# EAGLE board SDA381V8_B0 (EAGLE 9.6.2), part 1 of 6
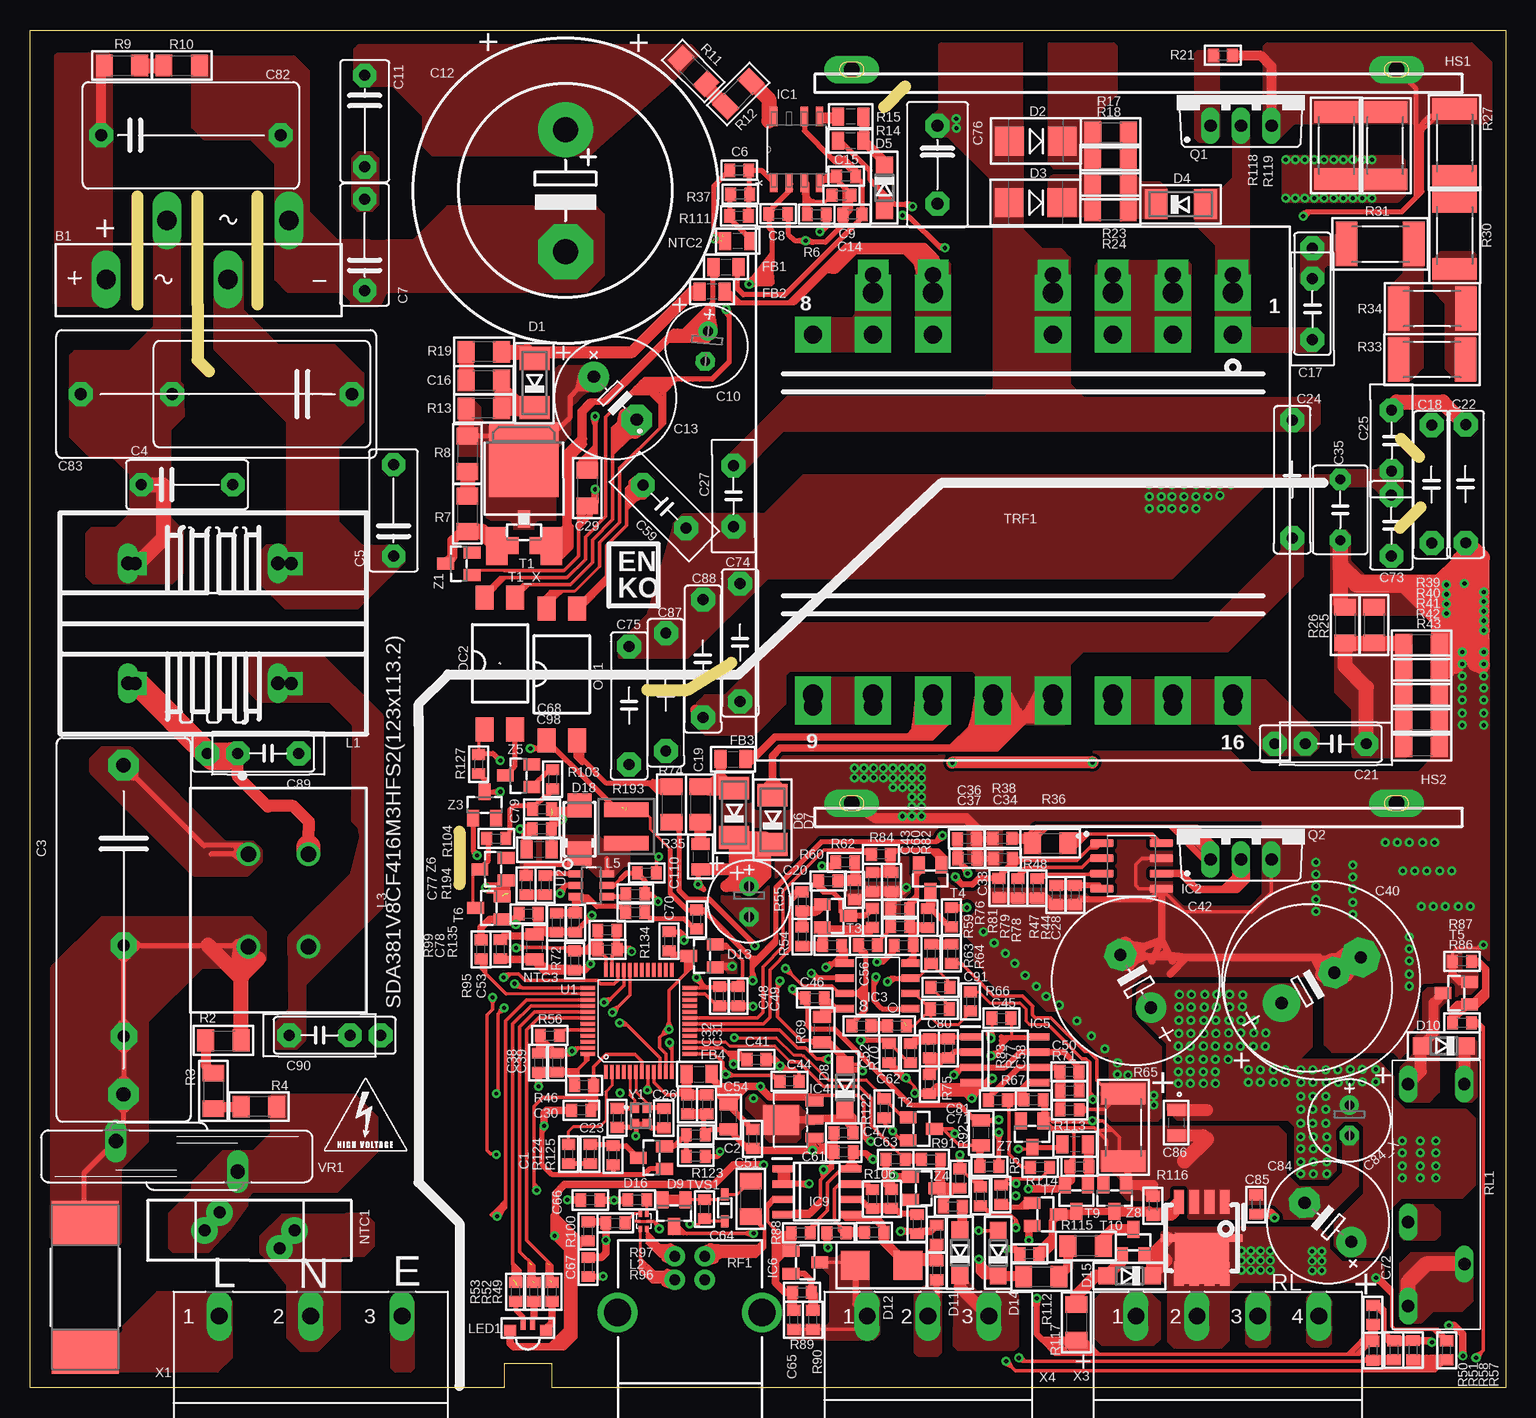
[diagram p2: board, top side]
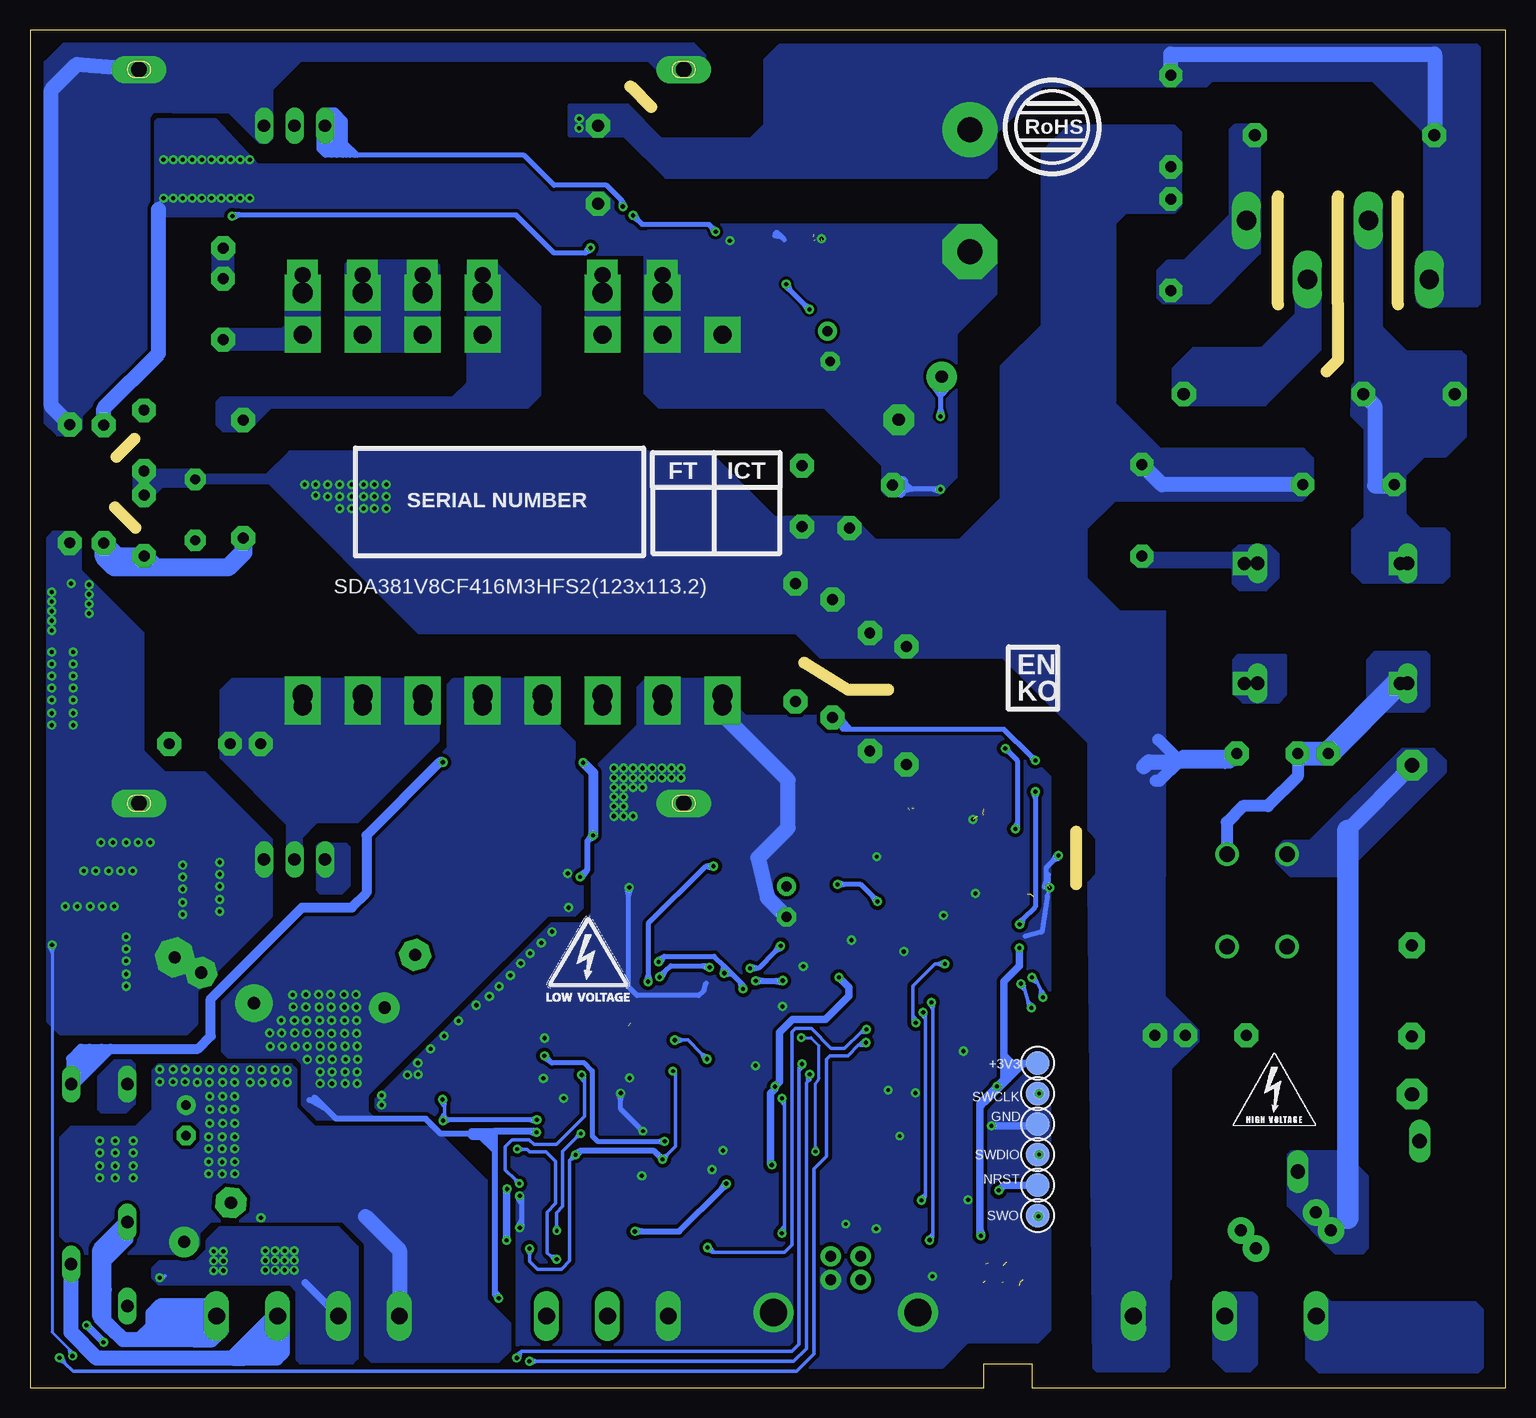
[diagram p3: board, bottom side, seen from below]

Size 123 x 113.2 mm. Coordinates in mm from the lower left corner, seen from the top.
Outline: 0,0 0,113.2 123,113.2 123,0 43.5,0 43.5,2 39.5,2 39.5,0 0,0
Copper layers (1*16): Top 0.035mm / dielectric 1.5mm / Bottom 0.035mm
Design rules "enkoarge *": minimum track width 10mil, minimum drill 0.3mm, track to track 9.5mil, track to pad 9.5mil, pad to pad 9.5mil, via to via 9.5mil, smd to smd 9.5mil, copper to edge 40mil, drill to drill 8mil, minimum pad ring 5mil, minimum via ring 8mil, stop-mask expansion 4mil, vias tented up to drill 0.35mm, thermal gap 11mil
Milling: 8 lines

## Footprints (pad centres in the part's own frame; a part is rotated, then mirrored left to right if it is on the bottom)
DıODE_BRIDGE_8A_DIK = drill 1.6 long: + -7.62,0.08; - 7.62,5; AC1 -2.54,5; AC2 2.54,0.08
C0603_ENKO = smd 0.9 x 1.1: 1 -0.794,0; 2 0.794,0
C275-113X316_&_C150-072X183_&_C225-113X268 = drill 1.194 pad 2.54 octagon: 1 -13.716,0; 2 13.716,0 | drill 1.016 pad 2.184 octagon: 3 -13.733,0.02; 4 8.873,0.02; 5 -13.693,0; 6 1.293,0
C075-042X103 = drill 0.914 pad 1.93 octagon: 1 -3.81,0; 2 3.81,0
E2,5-7 = drill 0.813 pad 1.6: + -1.27,0 | drill 0.813 pad 1.6 octagon: - 1.27,0
EB25D = drill 2.1 pad 4.597: + -5.08,0 | drill 2.1 pad 4.597 octagon: - 5.08,0
E5-10,5 = drill 1.016 pad 2.54: + -2.54,0 | drill 1.016 pad 2.54 octagon: - 2.54,0
C1206_ENKO = smd 1.4 x 1.8: 1 -1.479,0; 2 1.479,0
C075-32X103/C050-035X75 = drill 0.914 pad 2 octagon: 1 -3.81,0; 2 3.81,0 | drill 0.914 pad 1.981 octagon: 3 -3.81,0; 4 1.27,0
C075-32X103_DEIF = drill 0.914 pad 2 octagon: P$1 -4.92,0; P$2 4.92,0
C50-035X75 = drill 0.914 pad 1.981 octagon: 1 -2.54,0; 2 2.54,0
C050-045X075 = drill 0.813 pad 1.778 octagon: 1 -2.54,0; 2 2.54,0
E5-13/E7,5-16 = drill 1.016 pad 3.15: + -3.81,0 | drill 1.016 pad 2.54: +1 -3.81,0 | drill 1.016 pad 3.15 octagon: - 3.81,0 | drill 1.016 pad 2.54 octagon: -1 1.27,0
E5-13 = drill 1.016 pad 2.54: + -2.54,0 | drill 1.016 pad 2.54 octagon: - 2.54,0
C0805_ENKO = smd 1 x 1.5: 1 -1.052,0; 2 1.052,0
C050-035X075 = drill 0.914 pad 1.981 octagon: 1 -2.54,0; 2 2.54,0
C065-052X106 = drill 1 pad 2 octagon: 1 -3.25,0; 2 3.25,0
C150-091X182 = drill 1 pad 2 octagon: 1 -7.493,0; 2 7.493,0
C150-091X182_C225-108X268 = drill 1.016 pad 2 octagon: 1 -11.303,0; 2 11.303,0; 3 -11.303,0; 4 3.683,0
M7_DC_DIYOT = smd 1.9 x 2.5: A -2.05,0; C 2.05,0
SMB = smd 2.4 x 2.4: A 2.2,0; C -2.2,0
SOD123 = smd 1.4 x 1.4: A 1.9,0; C -1.9,0
SOT23 = smd 1 x 1.4: 1 -0.95,-1.1; 2 0.95,-1.1; 3 0,1.1
TRANSIL_SMB = smd 2.4 x 2.4: A 2.2,0; A1 -2.2,0
SMA = smd 2 x 2: A 2,0; C -2,0
FUSE_1350HV_EAT = smd 3.658 x 5.563: 1 -5.372,0; 2 5.372,0
R0805_ENKO = smd 1 x 1.5: 1 -1.052,0; 2 1.052,0
DEIF_SOGUTUCU_2 = drill 1.3 pad 2.3 long: 1 -23.9,0.91; 2 21.5,0.91
NCP1239_SMPS_IC = smd 1.6 x 0.6: 1 -2.76,1.905; 2 -2.76,0.635; 3 -2.76,-0.635; 4 -2.76,-1.905; 5 2.76,-1.905; 6 2.76,-0.635; 8 2.76,1.905
NCP4306 = smd 1.97 x 0.6: 1 -2.475,1.905; 2 -2.475,0.635; 3 -2.475,-0.635; 4 -2.475,-1.905; 5 2.475,-1.905; 6 2.475,-0.635; 7 2.475,0.635; 8 2.475,1.905
SO-8 = smd 1.524 x 0.61: 1 -2.743,1.92; 2 -2.743,0.65; 3 -2.743,-0.62; 4 -2.743,-1.89; 5 2.743,-1.89; 6 2.743,-0.62; 7 2.743,0.65; 8 2.743,1.92
SOT89 = smd 0.8 x 1.5: 1 -1.5,-1.75; 2 0,-1.75; 3 1.5,-1.75 | smd 2.5 x 3: 4 0,1.05
SO08 = smd 0.6 x 1.8: 1 -1.905,-2.8; 2 -0.635,-2.8; 3 0.635,-2.8; 4 1.905,-2.8; 5 1.905,2.8; 6 0.635,2.8; 7 -0.635,2.8; 8 -1.905,2.8
TL431_SOT23F = smd 1 x 1.4: A 0,1.2; C -0.95,-1.2; R 0.95,-1.2
TPH6R30ANL = smd 0.8 x 2: D 1.905,3; D1 0.635,3; D2 -0.635,3; D3 -1.905,3; GATE 1.905,-3; S -1.905,-3; S1 -0.635,-3; S2 0.635,-3 | smd 1.27 x 0.635: P$1 -2.75,0; P$2 2.75,0 | smd 4.5 x 4.25: P$3 0,1.7
UU1620_&_FWCMET24V = drill 1.1 pad 1.93 square: 1 -5,-6.5; 2 5,-6.5; 3 -5,6.5; 4 5,6.5 | drill 1.118 long: 5 -5,-5.385; 6 5,-5.385; 7 4.999,7.115; 8 -5.001,7.113
EXC24CS_COMMON_MODE = smd 0.4 x 0.2: 1 -0.5,0; 4 0.5,0 | smd 0.3 x 0.5: 2 -0.275,-0.625; 3 0.275,-0.625; 5 0.275,0.625; 6 -0.275,0.625
WE-CMB_NIZN_S = drill 1.3: 1 -3.85,-2.5; 2 3.85,-2.5; 3 3.85,2.5; 4 -3.85,2.5
INDUCTOR-NR4018 = smd 1.2 x 3.7: 1 -1.4,0; 2 1.4,0
KPFA-3010RGBC-11 = smd 1 x 0.9: 1 -1.5,0.2; 2 1.5,0.2 | smd 0.4 x 0.8: 3 0.4,-0.25; 4 -0.4,-0.25
NTC_15R_2A_&_N15SP005-5 = drill 1 pad 2.184: P$1 -2.5,1.5; P$2 2.5,-1.5; P$3 3.75,0; P$4 -3.75,0
PS2561DL2-1_OPTO1 = smd 1.5 x 2: 1 -1.27,-5.5; 2 1.27,-5.5; 3 1.27,5.5; 4 -1.27,5.5
PROG_6PIN = smd 2 x 2: 1 0,6.35; 2 0,3.81; 3 0,1.27; 4 0,-1.27; 5 0,-3.81; 6 0,-6.35
TO220BV = drill 1.016 long: D 0,-2.54; G -2.54,-2.54; S 2.54,-2.54
R1206_ENKO = smd 1.4 x 1.8: 1 -1.479,0; 2 1.479,0
R0603_ENKO = smd 0.9 x 1.1: 1 -0.794,0; 2 0.794,0
R2512 = smd 1.8 x 3.7: 1 -2.8,0; 2 2.8,0
ALD1_AND_ALJ_RELAY = drill 1.016 pad 1.27 long: 1 -8.997,-2.129; 2 -8.998,2.565; P0 9.505,-2.132; P1 6.007,2.571; S0 2.507,-2.129
DPAK = smd 1.8 x 3.2: 1 -2.28,-4.8; 3 2.28,-4.8 | smd 5.8 x 6.2: 4 0,2.38
SOT23-BEC = smd 1 x 1.4: B -0.95,-1.1; C 0,1.1; E 0.95,-1.1
DEIF_TRF = drill 1.7 pad 3 square: 1 -16.75,12.5; 2 -16.75,7.5; 3 -16.75,2.5; 5 -16.75,-7.5; 6 -16.75,-12.5; 6.5 16.75,-17.5; 7 16.75,-12.5; 8 16.75,-7.5; 9 16.75,-2.5; 10 16.75,2.5; 11 16.75,7.5; 12 16.75,12.5; 13 16.75,17.5; 55 -16.75,17.5 | drill 1.5 pad 3 square: 6.1 17.745,-17.5; 6.2 16.75,-17.5; 19 17.745,12.5; 20 17.745,7.5; 21 17.745,2.5; 22 17.745,-2.5; 23 17.745,-7.5; 24 17.745,-12.5; 25 17.745,17.5; 27 16.75,-12.5; 28 16.75,-7.5; 29 16.75,-2.5; 30 16.75,2.5; 31 16.75,7.5; 32 16.75,12.5; 38 16.75,17.5; 40 16.75,-17.5; 41 16.75,-12.5; 42 16.75,-7.5; 43 16.75,-2.5; 44 16.75,2.5; 45 16.75,7.5; 46 16.75,12.5; 47 16.75,17.5; 48 -13.25,-17.5; 49 -13.25,-12.5; 50 -13.25,-7.5; 52 -13.25,2.5; 53 -13.25,7.5; 54 -13.25,12.5; 58 -13.25,17.5 | drill 1.3 pad 2.54 square: 14 -18.255,-12.5; 15 -18.255,-7.5; 16 -18.255,2.5; 17 -18.255,7.5; 18 -18.255,12.5; 33 -18.25,-12.5; 34 -18.25,-7.5; 35 -18.25,2.5; 36 -18.25,7.5; 37 -18.25,12.5; 56 -18.255,17.5; 57 -18.25,17.5
SOD323 = smd 1 x 0.6: A 1.143,0; C -1.143,0
STM32F072CXXX_LQFP48 = smd 0.3 x 1.2: 1 -2.75,-4.25; 2 -2.25,-4.25; 3 -1.75,-4.25; 4 -1.25,-4.25; 5 -0.75,-4.25; 6 -0.25,-4.25; 7 0.25,-4.25; 8 0.75,-4.25; 9 1.25,-4.25; 10 1.75,-4.25; 11 2.25,-4.25; 12 2.75,-4.25; 25 2.75,4.25; 26 2.25,4.25; 27 1.75,4.25; 28 1.25,4.25; 29 0.75,4.25; 30 0.25,4.25; 31 -0.25,4.25; 32 -0.75,4.25; 33 -1.25,4.25; 34 -1.75,4.25; 35 -2.25,4.25; 36 -2.75,4.25 | smd 1.2 x 0.3: 13 4.25,-2.75; 14 4.25,-2.25; 15 4.25,-1.75; 16 4.25,-1.25; 17 4.25,-0.75; 18 4.25,-0.25; 19 4.25,0.25; 20 4.25,0.75; 21 4.25,1.25; 22 4.25,1.75; 23 4.25,2.25; 24 4.25,2.75; 37 -4.25,2.75; 38 -4.25,2.25; 39 -4.25,1.75; 40 -4.25,1.25; 41 -4.25,0.75; 42 -4.25,0.25; 43 -4.25,-0.25; 44 -4.25,-0.75; 45 -4.25,-1.25; 46 -4.25,-1.75; 47 -4.25,-2.25; 48 -4.25,-2.75
AOZ1282CI-1 = smd 1.2 x 0.6: 1 -1.298,0.95; 2 -1.298,0; 3 -1.298,-0.95; 4 1.298,-0.95; 5 1.298,0; 6 1.298,0.95
S20K40 = drill 1.194 long: 1 -1.27,-5.08; 2 1.27,5.08
GMSTBA3 = drill 1.397 long: 1 -7.62,5.08; 2 0,5.08; 3 7.62,5.08
USB_B(YATIK) = drill 0.914 pad 1.676: D+ 4,1.25; D- 5.981,1.25; GND 4,-1.25; VBUS 5.981,-1.25 | drill 2.286: SHLD1 1.282,-6.02; SHLD2 1.282,6.02
MSTBA4 = drill 1.397 long: 1 -7.62,5.08; 2 -2.54,5.08; 3 2.54,5.08; 4 7.62,5.08
MSTBA3 = drill 1.397 long: 1 -5.08,5.08; 2 0,5.08; 3 5.08,5.08
NX2016SA-32M = smd 0.85 x 0.75: 1 -0.675,-0.525; 2 0.675,-0.525; 3 0.675,0.525; 4 -0.675,0.525

## Placement (x,y rotation side)
B1  0119-1171**KOPRU DIYOT MONOFAZ 4A 1000V KBL  [DıODE_BRIDGE_8A_DIK]  13.97,92.33 0 top
C1  1019-3387**CAP 0603 CER 10uF 10V %10 X5R  [C0603_ENKO]  44.9,19.5 270 top
C2  1019-3387**CAP 0603 CER 10uF 10V %10 X5R  [C0603_ENKO]  55.5,21.1 180 top
C3  0019-2207**CAP TH POLY 1uF 305Vac %10 X2 MKP F=22.5mm (12x22x26.5)  [C275-113X316_&_C150-072X183_&_C225-113X268]  7.81,38.19 270 top
C4  1200920292**CAP TH CER 2.2nF 300Vac %20 X1Y2 F=7.5mm DxS(13x5)  [C075-042X103]  13.1,75.3 0 top
C5  1200920292**CAP TH CER 2.2nF 300Vac %20 X1Y2 F=7.5mm DxS(13x5)  [C075-042X103]  30.3,73.15 90 top
C6  1200920252**CAP 0603 CER 1nF 50V %10 X7R  [C0603_ENKO]  59.12,101.5 180 top
C7  1200920292**CAP TH CER 2.2nF 300Vac %20 X1Y2 F=7.5mm DxS(13x5)  [C075-042X103]  27.9,95.3 90 top
C8  1200920252**CAP 0603 CER 1nF 50V %10 X7R  [C0603_ENKO]  62.38,97.88 0 top
C9  1200920371**CAP 0603 CER 150p 50V%5 COG  [C0603_ENKO]  67.64,99.42 180 top
C10  0019-2279**CAP TH AL ELEC 47uF 50V %20 105C F=2.5/6.3x11 Low ESR, High Ripple Current  [E2,5-7]  56.4,86.84 265 top
C11  1200920292**CAP TH CER 2.2nF 300Vac %20 X1Y2 F=7.5mm DxS(13x5)  [C075-042X103]  27.9,105.6 270 top
C12  0019-3039**150uF 450V 105C %20 Ba:10 Yu: 41,5 çap: 25  [EB25D]  44.64,99.81 270 top
C13  0019-2196**CAP TH AL ELEC 47uF 100V %20 105C F=5/10x16  [E5-10,5]  48.79,82.5 315 top
C14  1200920567**CAP 0603 CER 1uF 25V %10X7R  [C0603_ENKO]  68.56,97.83 180 top
C15  1200920268**CAP 0603 CER 100nF 50V %10 X7R  [C0603_ENKO]  68.03,101 180 top
C16  NC**TAKILMAYACAK (Not Fitted)  [C1206_ENKO]  37.84,83.98 180 top
C17  0019-5007**CAP TH CER 150pF 630V COG %10 105C F=5  [C075-32X103/C050-035X75]  106.91,91.21 90 top
C18  0019-1298**CAP TH CER 1nF 500Vac X1/Y1 %20 F=10mm DxS(5x9)  [C075-32X103_DEIF]  116.84,75.33 90 top
C19  1200920078**CAP 1206 CER 1nF 50V %10 X7R  [C1206_ENKO]  55.86,48.64 90 top
C20  1200920283**CAP TH AL. ELEC 47uF 50V %20 105C L?1000H F=2.5/6.3x11  [E2,5-7]  59.94,40.54 270 top
C21  0019-1391**CAP TH CER 4700pF 250VAC 2.5kVDC X1Y2 %20 85C F=5mm  [C075-32X103/C050-035X75]  107.6,53.7 180 top
C22  0019-1298**CAP TH CER 1nF 500Vac X1/Y1 %20 F=10mm DxS(5x9)  [C075-32X103_DEIF]  119.67,75.37 90 top
C23  1019-3352**CAP 0603 CER 22pF 50V %5 NPO  [C0603_ENKO]  48.95,22.51 270 top
C24  0019-1299**CAP TH CER 2.2nF 500Vac X1/Y1 %20 F=10mm DxS(5x12)  [C075-32X103_DEIF]  105.22,75.75 90 top
C25  NC**TAKILMAYACAK (Not Fitted)  [C50-035X75]  113.5,78.96 90 top
C26  1019-3352**CAP 0603 CER 22pF 50V %5 NPO  [C0603_ENKO]  52.83,22.48 270 top
C27  NC**TAKILMAYACAK (Not Fitted)  [C50-035X75]  58.64,74.35 90 top
C28  1200920268**CAP 0603 CER 100nF 50V %10 X7R  [C0603_ENKO]  87.12,41.1 90 top
C29  NC**TAKILMAYACAK (Not Fitted)  [C1206_ENKO]  46.47,75.01 90 top
C30  1200920268**CAP 0603 CER 100nF 50V %10 X7R  [C0603_ENKO]  45.95,23.15 0 top
C31  1200920268**CAP 0603 CER 100nF 50V %10 X7R  [C0603_ENKO]  56.41,23.63 270 top
C32  1019-3167**CAP 0603 CER 10nF 50V %10 X7R (AbC)  [C0603_ENKO]  54.81,23.63 270 top
C33  1200920268**CAP 0603 CER 100nF 50V %10 X7R  [C0603_ENKO]  80.77,41.68 90 top
C34  1200920567**CAP 0603 CER 1uF 25V %10X7R  [C0603_ENKO]  81.11,44.14 0 top
C35  0019-1391**CAP TH CER 4700pF 250VAC 2.5kVDC X1Y2 %20 85C F=5mm  [C050-045X075]  109.23,73.2 90 top
C36  1200920268**CAP 0603 CER 100nF 50V %10 X7R  [C0603_ENKO]  78.11,45.77 0 top
C37  1200920268**CAP 0603 CER 100nF 50V %10 X7R  [C0603_ENKO]  78.14,44.12 0 top
C38  1200920268**CAP 0603 CER 100nF 50V %10 X7R  [C0603_ENKO]  42.41,27.11 90 top
C39  1019-3167**CAP 0603 CER 10nF 50V %10 X7R (AbC)  [C0603_ENKO]  43.91,27.12 90 top
C40  0019-3046**CAP TH AL ELEC 1000uF 35V %20 105C F=5/12.5x25 LOW ESR  [E5-13/E7,5-16]  107.63,33.98 30 top
C41  1200920268**CAP 0603 CER 100nF 50V %10 X7R  [C0603_ENKO]  60.57,27.37 0 top
C42  0019-3046**CAP TH AL ELEC 1000uF 35V %20 105C F=5/12.5x25 LOW ESR  [E5-13]  92.17,33.9 120 top
C43  1019-3387**CAP 0603 CER 10uF 10V %10 X5R  [C0603_ENKO]  68.72,41.52 90 top
C44  1200920268**CAP 0603 CER 100nF 50V %10 X7R  [C0603_ENKO]  63.3,25.56 0 top
C45  1200920268**CAP 0603 CER 100nF 50V %10 X7R  [C0603_ENKO]  80.98,30.82 180 top
C46  1200920268**CAP 0603 CER 100nF 50V %10 X7R  [C0603_ENKO]  65.42,32.51 0 top
C47  1200920567**CAP 0603 CER 1uF 25V %10X7R  [C0603_ENKO]  67.82,21.27 180 top
C48  1019-3167**CAP 0603 CER 10nF 50V %10 X7R (AbC)  [C0603_ENKO]  57.47,32.65 270 top
C49  1200920268**CAP 0603 CER 100nF 50V %10 X7R  [C0603_ENKO]  59.03,32.65 270 top
C50  NC**TAKILMAYACAK (Not Fitted)  [C0603_ENKO]  86.65,26.36 0 top
C51  1200920268**CAP 0603 CER 100nF 50V %10 X7R  [C0603_ENKO]  60.24,20.76 270 top
C52  1019-3158**CAP 0603 CER 220nF 25V %10 X7R (AbC)  [C0603_ENKO]  69.3,30.2 180 top
C53  1200920268**CAP 0603 CER 100nF 50V %10 X7R  [C0603_ENKO]  39.21,36.57 90 top
C54  1019-3301**CAP 0805 47uF 6.3V %20 X5R  [C0805_ENKO]  58.23,22.59 270 top
C55  1019-3167**CAP 0603 CER 10nF 50V %10 X7R (AbC)  [C0603_ENKO]  48.14,36.54 0 top
C56  1019-3158**CAP 0603 CER 220nF 25V %10 X7R (AbC)  [C0603_ENKO]  69.86,36.9 180 top
C57  1200920268**CAP 0603 CER 100nF 50V %10 X7R  [C0603_ENKO]  48.12,38.15 0 top
C58  1200920371**CAP 0603 CER 150p 50V%5 COG  [C0603_ENKO]  76.57,28.3 90 top
C59  NC**TAKILMAYACAK (Not Fitted)  [C50-035X75]  52.88,73.47 135 top
C60  1019-3387**CAP 0603 CER 10uF 10V %10 X5R  [C0603_ENKO]  70.24,42.18 90 top
C61  1200920268**CAP 0603 CER 100nF 50V %10 X7R  [C0603_ENKO]  67.84,19.66 180 top
C62  1200920268**CAP 0603 CER 100nF 50V %10 X7R  [C0603_ENKO]  71.63,27.92 90 top
C63  1019-3167**CAP 0603 CER 10nF 50V %10 X7R (AbC)  [C0603_ENKO]  72.16,19.06 180 top
C64  1200920268**CAP 0603 CER 100nF 50V %10 X7R  [C0603_ENKO]  56.23,14.91 270 top
C65  1200920268**CAP 0603 CER 100nF 50V %10 X7R  [C0603_ENKO]  63.66,5.67 90 top
C66  1019-3381**CAP 0603 CER 33pf 50V %5 NPO(COG)  [C0603_ENKO]  46.71,15.66 180 top
C67  1019-3381**CAP 0603 CER 33pf 50V %5 NPO(COG)  [C0603_ENKO]  46.53,10.08 270 top
C68  1200920268**CAP 0603 CER 100nF 50V %10 X7R  [C0603_ENKO]  42.69,48.25 180 top
C69  1200920268**CAP 0603 CER 100nF 50V %10 X7R  [C0603_ENKO]  79.23,15.96 90 top
C70  1200920268**CAP 0603 CER 100nF 50V %10 X7R  [C0603_ENKO]  53.26,37.23 270 top
C71  1200920082**CAP 0805 CER 100nF 50V %10 X7R  [C0805_ENKO]  79.29,21.26 90 top
C72  1019-3167**CAP 0603 CER 10nF 50V %10 X7R (AbC)  [C0603_ENKO]  111.95,6.1 270 top
C73  0019-1391**CAP TH CER 4700pF 250VAC 2.5kVDC X1Y2 %20 85C F=5mm  [C050-035X075]  113.49,71.9 90 top
C74  0019-1391**CAP TH CER 4700pF 250VAC 2.5kVDC X1Y2 %20 85C F=5mm  [C075-32X103_DEIF]  59.2,62.15 90 top
C75  0019-1391**CAP TH CER 4700pF 250VAC 2.5kVDC X1Y2 %20 85C F=5mm  [C075-32X103_DEIF]  49.95,56.9 90 top
C76  NC**TAKILMAYACAK (Not Fitted)  [C065-052X106]  75.64,101.98 270 top
C77  1200920268**CAP 0603 CER 100nF 50V %10 X7R  [C0603_ENKO]  41.36,41.91 90 top
C78  1019-3352**CAP 0603 CER 22pF 50V %5 NPO  [C0603_ENKO]  43.89,38.78 270 top
C79  1019-3243**CAP 0805 CER 10uF 50V ±10% X5R -55°C ~ 85°C  [C0805_ENKO]  42.43,44.87 180 top
C80  NC**TAKILMAYACAK (Not Fitted)  [C0603_ENKO]  75.86,31.57 0 top
C81  NC**TAKILMAYACAK (Not Fitted)  [C0603_ENKO]  80.69,23.99 0 top
C82  NC**TAKILMAYACAK (Not Fitted)  [C150-091X182]  13.41,104.42 0 top
C83  0019-1383**CAP TH POLY 220nF 305Vac 105C %20 X2 F=15/7x13.5x18  [C150-091X182_C225-108X268]  15.53,82.84 180 top
C84  0019-7012**CAP TH AL. ELEC 470uF 35V %20 105C F=5/10X16 L.ESR 3000H  [E5-10,5]  108.2,13.8 140 top
C84_X  NC**TAKILMAYACAK (Not Fitted)  [E2,5-7]  109.99,22.31 270 top
C85  1200920268**CAP 0603 CER 100nF 50V %10 X7R  [C0603_ENKO]  102.2,15.29 90 top
C86  1200920082**CAP 0805 CER 100nF 50V %10 X7R  [C0805_ENKO]  95.55,22.12 270 top
C87  0019-3044**CAP TH CER 1nF 400VAC X1 %20 85C F=5 veya F=7.5 D=6.5  [C075-32X103_DEIF]  53,58 90 top
C88  0019-3044**CAP TH CER 1nF 400VAC X1 %20 85C F=5 veya F=7.5 D=6.5  [C075-32X103_DEIF]  56.1,60.8 90 top
C89  0019-1296**CAP TH CER 470pF 300Vac X1/Y2 %20 F=7.5mm DxS(5x8)  [C075-32X103/C050-035X75]  18.6,52.9 180 top
C90  0019-1296**CAP TH CER 470pF 300Vac X1/Y2 %20 F=7.5mm DxS(5x8)  [C075-32X103/C050-035X75]  25.4,29.4 0 top
C91  NC**TAKILMAYACAK (Not Fitted)  [C0603_ENKO]  75.9,33.4 180 top
C98  1200920252**CAP 0603 CER 1nF 50V %10 X7R  [C0603_ENKO]  42.67,46.59 180 top
C110  1200920268**CAP 0603 CER 100nF 50V %10 X7R  [C0603_ENKO]  51.42,42.94 180 top
D1  1200980554**DIODE SWITCHING SM 1000V 1A US1M  [M7_DC_DIYOT]  42.06,83.77 270 top
D2  1119-3074**P6SMB300CA - DIODE TVS 600W 256V DO214AA (SMB)  [SMB]  83.84,103.94 180 top
D3  1119-3074**P6SMB300CA - DIODE TVS 600W 256V DO214AA (SMB)  [SMB]  83.82,98.81 180 top
D4  1200980554**DIODE SWITCHING SM 1000V 1A US1M  [M7_DC_DIYOT]  95.92,98.66 180 top
D5  NC**AKILMAYACAK (Not Fitted)  [SOD123]  71.22,100.05 270 top
D6  1200980554**DIODE SWITCHING SM 1000V 1A US1M  [M7_DC_DIYOT]  58.69,47.94 270 top
D7  1200980468**DIODE RECTIFIER SMD 1000V 1A GS1M  [M7_DC_DIYOT]  61.89,47.36 270 top
D8  1200980377**DIODE SWITCHING SMD 75V 200mA SOD-123 1N4148W  [SOD123]  67.95,25.05 90 top
D9  1119-3027**DIODE 75V 200MA SOT23 BAS16 (AbC)  [SOT23]  53.68,14.57 180 top
D10  1200980377**DIODE SWITCHING SMD 75V 200mA SOD-123 1N4148W  [SOD123]  117.85,28.52 180 top
D11  1200980377**DIODE SWITCHING SMD 75V 200mA SOD-123 1N4148W  [SOD123]  77.52,11.28 90 top
D12  1119-3072**DIODE TVS 600W 12V DO214AA BIPOLAR  [TRANSIL_SMB]  71,10.22 0 top
D13  1200980593**DIODE SCHOTTKY BARRIER DOUBLE SMD 30V 200mA BAT54S  [SOT23]  56.02,36.02 90 top
D14  1200980377**DIODE SWITCHING SMD 75V 200mA SOD-123 1N4148W  [SOD123]  80.71,11.24 90 top
D15  1200980377**DIODE SWITCHING SMD 75V 200mA SOD-123 1N4148W  [SOD123]  91.66,9.34 180 top
D16  1200980593**DIODE SCHOTTKY BARRIER DOUBLE SMD 30V 200mA BAT54S  [SOT23]  51.8,19.2 90 top
D18  1200980432**DIODE SCHOTTKY RECTIFIER SMD SMA/DO_214AC 60V 2A STPS2L60A  [SMA]  45.81,46.56 90 top
F1  1169-1203**FUSE SMD 5A 350VAC 500VDC 2-SMD Breaking Cap: 100A I2t:11.5  [FUSE_1350HV_EAT]  4.6,8.4 90 top
FB1  1319-4060**Ferrite Bead SMD 0805 2kOhm@100MHz 300mA LAIRD HZ0805C202R-10  [R0805_ENKO]  58.02,93.45 0 top
FB2  1319-4060**Ferrite Bead SMD 0805 2kOhm@100MHz 300mA LAIRD HZ0805C202R-10  [R0805_ENKO]  56.85,91.38 180 top
FB3  1319-4060**Ferrite Bead SMD 0805 2kOhm@100MHz 300mA LAIRD HZ0805C202R-10  [R0805_ENKO]  58.6,52.41 0 top
FB4  1319-4060**Ferrite Bead SMD 0805 2kOhm@100MHz 300mA LAIRD HZ0805C202R-10  [R0805_ENKO]  55.76,26.16 0 top
HS1  0139-1131**DBC2 90/150W Heatsink Düz Formlu [ARGE?]  [DEIF_SOGUTUCU_2]  92.41,109 0 top
HS2  0139-1131**DBC2 90/150W Heatsink Düz Formlu [ARGE?]  [DEIF_SOGUTUCU_2]  92.41,47.82 0 top
IC1  1039-9014**IC SMPS CONTROLLER FLYBACK FIXED FREQ. ONSEMI NCP1239ED65R2G  [NCP1239_SMPS_IC]  63.91,103.24 90 top
IC2  1039-9013**NCP4306AADZZZADR2G SOIC-8 (senkron IC) Synchronous Rectification Controller for Flyback  [NCP4306]  91.83,43.51 0 top
IC3  1039-2224**TSM1011ID SO-8 Constant Voltage and Constant Current Controller  [SO-8]  70.66,33.53 180 top
IC4  1039-3003**Voltage Regulator SOT-89 3.3V Diodes AP2204RA-3.3TRG1  [SOT89]  63.65,22.36 90 top
IC5  1039-2009**OPAMP 3-32 V Dual 70C SO8 LM358  [SO08]  81.28,27.36 270 top
IC6  1200980448**IC REGULATOR VOLTAGE SMD ZTL431AFFTA 2.5V %1  [TL431_SOT23F]  64.63,10.46 270 top
IC8  1109-4211**Mosfet N-Ch 100V 90A Rds:3.7mR 8-SOP Advance (5x5) TPH3R70APL  [TPH6R30ANL]  97.67,12.5 180 top
IC9  1039-2009**OPAMP 3-32 V Dual 70C SO8 LM358  [SO08]  65.59,16.36 270 top
L1  0319-5030**LINE FILTER 2x7mH 1,5A COMMON MODE CHOKE (UU1620)  [UU1620_&_FWCMET24V]  15.28,63.73 90 top
L2  1319-4100**EXC24 Common Mode Noise Filters with ESD Suppressor(0504 Size)  [EXC24CS_COMMON_MODE]  51.15,13.9 0 top
L3  0319-7457**Common Mode Chokes / Filters WE-CMB Power Type S 42uH 100kHz 8.1mOhm 744842742  [WE-CMB_NIZN_S]  20.7,40.65 270 top
L5  1319-4102**INDUCTOR POWER 22UH 4X4X1.8MM SMD  [INDUCTOR-NR4018]  49.7,46.8 90 top
LED1  1209-0011**LED, RGB, Red, Green, Blue, SMD, 1mm x 3mm, 120 °, Dome, R 20mA, G 20mA, B 20mA (Right Angle)  [KPFA-3010RGBC-11]  41.5,5 180 top
NTC1  0169-2029**SURGE PROTECTOR-In rush Current Limitter NTC N10SP005  [NTC_15R_2A_&_N15SP005-5]  18.3,13.12 0 top
NTC2  1200970116**RES 0805 0R %5  [R0805_ENKO]  59,95.6 180 top
NTC3  1169-1001**TSM2A103F3951RZ THINKING 0805 10K NTC 125C  [R0805_ENKO]  42.08,36.77 90 top
OC1  1200980560**OPTOCOUPLER SMD PS2561DL2-1Y-V-F3-A/L CTR: 200˜400  [PS2561DL2-1_OPTO1]  44.34,59.48 0 top
OC2  1200980560**OPTOCOUPLER SMD PS2561DL2-1Y-V-F3-A/L CTR: 200˜400  [PS2561DL2-1_OPTO1]  39.18,60.4 0 top
PCB  0369-5199**PCB [ARGE?] SDA381V8CF416M3HFS2(123x113.2)  [PCB]  -5.84,108.92 0 top  (outside the outline)
PROG1  NC**TAKILMAYACAK (Not Fitted)  [PROG_6PIN]  38.98,20.71 0 bottom
Q1  0109-4091**Mosfet N-Ch 800V 9A 0.16R TO-220FP Vishay SIHA24N80AE-GE3 [ARGE?]  [TO220BV]  100.95,107.76 0 top
Q2  1109-4204**Mosfet N-Ch 100V 64A Rds:4.5mR TO-220FP  [TO220BV]  100.95,46.59 0 top
R2  1200970587**RES 1206 470K %5 1/4W  [R1206_ENKO]  16.13,28.97 180 top
R3  1200970587**RES 1206 470K %5 1/4W  [R1206_ENKO]  15.28,24.77 90 top
R4  1200970587**RES 1206 470K %5 1/4W  [R1206_ENKO]  19.09,23.44 0 top
R5  NC**TAKILMAYACAK  [R0603_ENKO]  84.2,18.4 0 top
R6  1200970583**RES 0603 1K %1 1/10W  [R0603_ENKO]  65.59,97.83 0 top
R7  1029-4050**RES 1206 6K8 %1  [R1206_ENKO]  36.46,72.87 90 top
R8  1029-4050**RES 1206 6K8 %1  [R1206_ENKO]  36.47,77.86 90 top
R9  1200970179**RES 1206 330K %5 1/4W  [R1206_ENKO]  7.68,110.24 180 top
R10  1200970179**RES 1206 330K %5 1/4W  [R1206_ENKO]  12.65,110.23 180 top
R11  1200970154**RES 1206 2K2 %5 1/4W  [R1206_ENKO]  55.31,109.77 135 top
R12  1200970154**RES 1206 2K2 %5 1/4W  [R1206_ENKO]  59.04,107.87 45 top
R13  1029-3146**RES 1206 7R68 %1  [R1206_ENKO]  37.83,81.64 0 top
R14  1200970118**RES 0805 100R %5 1/8W  [R0805_ENKO]  68.41,103.99 0 top
R15  1200970434**RES 0805 47R %5 1/8W  [R0805_ENKO]  68.41,105.98 180 top
R17  1029-3146**RES 1206 7R68 %1  [R1206_ENKO]  90.09,104.63 0 top
R18  1029-3146**RES 1206 7R68 %1  [R1206_ENKO]  90.07,102.44 0 top
R19  NC**TAKILMAYACAK (Not Fitted)  [R1206_ENKO]  37.84,86.36 0 top
R21  1200970568**RES 0603 47K %5 1/10W  [R0603_ENKO]  99.44,111.08 180 top
R23  1029-3146**RES 1206 7R68 %1  [R1206_ENKO]  90.07,100.3 0 top
R24  1029-3146**RES 1206 7R68 %1  [R1206_ENKO]  90.07,98.18 0 top
R25  1200970119**RES 1206 100R %5 1/4W  [R1206_ENKO]  112.05,63.59 90 top
R26  1200970119**RES 1206 100R %5 1/4W  [R1206_ENKO]  109.64,63.59 90 top
R27  1029-6097**RES 2512 22R %5 1W  [R2512]  118.75,103.81 270 top
R30  1029-6097**RES 2512 22R %5 1W  [R2512]  118.76,96.07 270 top
R31  1029-6097**RES 2512 22R %5 1W  [R2512]  112.55,95.36 0 top
R33  1029-6110**RES 2512 47R %5 1W  [R2512]  116.88,85.72 180 top
R34  1029-6110**RES 2512 47R %5 1W  [R2512]  116.89,89.97 180 top
R35  1029-3008**RES 0805 22R %5  [R0805_ENKO]  55.89,44.28 270 top
R36  1200970117**RES 1206 0R %5  [R1206_ENKO]  85.05,45.41 180 top
R37  1200970687**RES 0603 56K %1 1/10W  [R0603_ENKO]  59.2,99.5 180 top
R38  1200970568**RES 0603 47K %5 1/10W  [R0603_ENKO]  81.07,45.8 180 top
R39  1200970119**RES 1206 100R %5 1/4W  [R1206_ENKO]  116,61.95 0 top
R40  1200970119**RES 1206 100R %5 1/4W  [R1206_ENKO]  116,59.87 0 top
R41  1200970119**RES 1206 100R %5 1/4W  [R1206_ENKO]  116,57.78 0 top
R42  1200970119**RES 1206 100R %5 1/4W  [R1206_ENKO]  116,55.64 0 top
R43  1200970554**RES 1206 56R %1 1/4W  [R1206_ENKO]  116,53.48 0 top
R44  1200970568**RES 0603 47K %5 1/10W  [R0603_ENKO]  85.54,41.1 270 top
R46  1200971020**RES 0603 10K %1 1/10W  [R0603_ENKO]  46.18,25.23 0 top
R47  1200971020**RES 0603 10K %1 1/10W  [R0603_ENKO]  83.95,41.65 270 top
R48  1200970516**RES 0603 22K %5 1/10W  [R0603_ENKO]  82.36,41.65 270 top
R49  1029-2005**RES 0603 220R %1  [R0603_ENKO]  43.52,8.02 270 top
R50  1200970803**RES 0603 100K %1 1/10W  [R0603_ENKO]  111.95,3.11 270 top
R51  1200971020**RES 0603 10K %1 1/10W  [R0603_ENKO]  113.71,3.15 90 top
R52  1029-2005**RES 0603 220R %1  [R0603_ENKO]  42,8.02 270 top
R53  1029-2005**RES 0603 220R %1  [R0603_ENKO]  40.48,8.02 270 top
R54  1200971020**RES 0603 10K %1 1/10W  [R0603_ENKO]  64.36,37.61 90 top
R55  1029-2233**RES 0603 2K2 %1  [R0603_ENKO]  64.36,40.56 90 top
R56  1200970522**RES 0603 1K %5 1/10W  [R0603_ENKO]  43.34,29.38 0 top
R57  1200970803**RES 0603 100K %1 1/10W  [R0603_ENKO]  118.09,3.15 270 top
R58  1200970770**RES 0603 4K3 %1 1/10W  [R0603_ENKO]  115.29,3.15 90 top
R59  1200970803**RES 0603 100K %1 1/10W  [R0603_ENKO]  70.22,39.17 270 top
R60  1029-2234**RES 0603 4K7 %1  [R0603_ENKO]  66.53,42.25 0 top
R61  1200970583**RES 0603 1K %1 1/10W  [R0603_ENKO]  66.87,36.9 0 top
R62  1200970706**RES 0603 1K8 %5 1/10W  [R0603_ENKO]  67.96,43.82 0 top
R63  1029-2003**RES 0603 10R %1  [R0603_ENKO]  75.12,36.19 270 top
R64  1029-2006**RES 0603 47R %1  [R0603_ENKO]  76.83,36.19 90 top
R65  1029-6021**RES 2512 0R003 %1 2W  [R2512]  91.14,21.72 270 top
R66  1200970927**RES 0603 100R %1 1/10W  [R0603_ENKO]  78.4,32.22 90 top
R67  1200970522**RES 0603 1K %5 1/10W  [R0603_ENKO]  83.66,24.01 0 top
R68  1200970522**RES 0603 1K %5 1/10W  [R0603_ENKO]  86.66,23.17 180 top
R69  1029-3008**RES 0805 22R %5  [R0805_ENKO]  66.03,29.87 90 top
R70  1200970843**RES 0603 15K %1 1/10W  [R0603_ENKO]  72.28,30.19 0 top
R71  1029-2234**RES 0603 4K7 %1  [R0603_ENKO]  86.67,24.79 0 top
R72  1200970583**RES 0603 1K %1 1/10W  [R0603_ENKO]  45.41,35.63 90 top
R74  1200970194**RES 1206 4K7 %5 1/4W  [R1206_ENKO]  53.48,48.64 90 top
R75  1200970583**RES 0603 1K %1 1/10W  [R0603_ENKO]  74.97,25.33 90 top
R76  1200970684**RES 0603 47K %1 1/10W  [R0603_ENKO]  72.54,38.49 0 top
R77  1029-6089**RES 0603 6K8 %5  [R0603_ENKO]  74.98,28.3 90 top
R78  1029-2203**RES 0603 12K %1  [R0603_ENKO]  76.82,39.23 90 top
R79  1029-2341**RES 0603 5K6 %1  [R0603_ENKO]  74.83,39.16 90 top
R80  1029-2234**RES 0603 4K7 %1  [R0603_ENKO]  72.83,36.89 0 top
R81  1200970583**RES 0603 1K %1 1/10W  [R0603_ENKO]  72.54,39.91 180 top
R82  1200971020**RES 0603 10K %1 1/10W  [R0603_ENKO]  71.83,42.19 270 top
R83  1200970522**RES 0603 1K %5 1/10W  [R0603_ENKO]  73.4,27.91 270 top
R84  1200970522**RES 0603 1K %5 1/10W  [R0603_ENKO]  70.94,44.48 0 top
R86  1200970522**RES 0603 1K %5 1/10W  [R0603_ENKO]  119.37,30.43 0 top
R87  1200971020**RES 0603 10K %1 1/10W  [R0603_ENKO]  119.37,35.56 0 top
R88  1029-2234**RES 0603 4K7 %1  [R0603_ENKO]  64.25,12.94 0 top
R89  1200970583**RES 0603 1K %1 1/10W  [R0603_ENKO]  64.35,7.96 180 top
R90  1029-2231**RES 0603 1K8 %1  [R0603_ENKO]  65.25,5.67 90 top
R91  1200971020**RES 0603 10K %1 1/10W  [R0603_ENKO]  75.12,19.05 0 top
R92  1200970568**RES 0603 47K %5 1/10W  [R0603_ENKO]  77.52,17.46 270 top
R93  1409-0025**RES 0603 470R %5 1/16W  [R0603_ENKO]  76.93,15.12 180 top
R94  1029-6086**RES 0603 22R %1  [R0603_ENKO]  75.59,9.79 90 top
R95  1200970583**RES 0603 1K %1 1/10W  [R0603_ENKO]  37.6,36.55 270 top
R96  1029-6086**RES 0603 22R %1  [R0603_ENKO]  48.8,13.76 180 top
R97  1029-6086**RES 0603 22R %1  [R0603_ENKO]  50.62,15.68 180 top
R98  1029-2234**RES 0603 4K7 %1  [R0603_ENKO]  75.58,12.78 90 top
R99  1200970516**RES 0603 22K %5 1/10W  [R0603_ENKO]  41.56,39.53 180 top
R100  1200970852**RES 0603 1K5 %5 1/10W ( <-1029-3501 )  [R0603_ENKO]  46.52,13.05 270 top
R101  1200970684**RES 0603 47K %1 1/10W  [R0603_ENKO]  73.95,13.65 270 top
R102  1200970583**RES 0603 1K %1 1/10W  [R0603_ENKO]  71.82,15.76 270 top
R103  1200970522**RES 0603 1K %5 1/10W  [R0603_ENKO]  43.57,50.74 90 top
R104  1200970522**RES 0603 1K %5 1/10W  [R0603_ENKO]  38.87,45.8 0 top
R105  1029-2229**RES 0603 120K %1  [R0603_ENKO]  70.38,12.97 180 top
R106  1029-2219**RES 0603 30K %1  [R0603_ENKO]  70.23,15.74 90 top
R107  1200970515**RES 0603 100K %5 1/10W  [R0603_ENKO]  83.31,11.17 180 top
R108  1200970730**RES 0603 560R %1 1/10W  [R0603_ENKO]  67.23,12.94 180 top
R109  1200971020**RES 0603 10K %1 1/10W  [R0603_ENKO]  80.95,16.11 90 top
R110  1200970516**RES 0603 22K %5 1/10W  [R0603_ENKO]  79.98,18.46 0 top
R111  NC**TAKILMAYACAK  [R0603_ENKO]  59.1,97.7 180 top
R112  1200970156**RES 1206 22K %5 1/4W  [R1206_ENKO]  84.3,9.29 180 top
R113  1200970121**RES 0805 1K %5 1/8W  [R0805_ENKO]  87.13,20.3 180 top
R114  1200971020**RES 0603 10K %1 1/10W  [R0603_ENKO]  87.49,18.46 180 top
R115  1200970156**RES 1206 22K %5 1/4W  [R1206_ENKO]  88.01,11.83 0 top
R116  1200970585**RES 0603 1M %5 1/10W  [R0603_ENKO]  93.61,15.19 270 top
R117  1029-6015**RES 1206 56K %5  [R1206_ENKO]  87.23,5.47 90 top
R118  1029-6105**RES 2512 330mR %1 2W  [R2512]  108.92,103.57 90 top
R119  1029-6105**RES 2512 330mR %1 2W  [R2512]  112.97,103.55 90 top
R122  1200970516**RES 0603 22K %5 1/10W  [R0603_ENKO]  71.2,23.3 90 top
R123  1200970522**RES 0603 1K %5 1/10W  [R0603_ENKO]  55.5,19.3 0 top
R124  1200970522**RES 0603 1K %5 1/10W  [R0603_ENKO]  46.7,19.5 90 top
R125  1200970516**RES 0603 22K %5 1/10W  [R0603_ENKO]  48.6,19.4 90 top
R127  1200971020**RES 0603 10K %1 1/10W  [R0603_ENKO]  37.4,52 90 top
R133  1200970626**RES 0603 82K %1 1/10W  [R0603_ENKO]  55.56,39.05 90 top
R134  1029-2234**RES 0603 4K7 %1  [R0603_ENKO]  50.45,39.66 0 top
R135  1200970940**RES 0603 6K8 %1 1/10W  [R0603_ENKO]  45.46,38.79 90 top
R193  1200970934**RES 0603 470K %1 1/10W  [R0603_ENKO]  50.45,41.17 0 top
R194  1200970528**RES 0603 0R %5 1/10W  [R0603_ENKO]  42.95,41.91 270 top
RF1  1169-1006**FUSE SMD 1206 PTC RESETTABLE 16V IHOLD=0.75A IMAX=100A  [R1206_ENKO]  60.07,15.76 270 top
RL1  1200930051**RELAY SPST 12V 5A 7x15x20.3mm  [ALD1_AND_ALJ_RELAY]  117.01,16.33 270 top
STENCIL  041-7604**SDA381V8 için Çerçeveli Elek (Stencil) (600x600)  [PCB]  -5.88,105.57 0 top  (outside the outline)
T1  1109-1016**Transistor NPN 3A 100V 15W Hfemin:10 DPAK Diodes MJD31C-13  [DPAK]  41.18,74.98 0 top
T1_X  NC**TAKILMAYACAK (Not Fitted)  [SOT23-BEC]  41.18,71.32 0 top
T2  1200980090**TRANS SMD NPN BC847B SOT-23  [SOT23-BEC]  74.3,21.6 270 top
T3  1200980091**TRANS SMD PNP BC857B SOT-23  [SOT23-BEC]  67.14,39.35 270 top
T4  1200980090**TRANS SMD NPN BC847B SOT-23  [SOT23-BEC]  75.04,42.48 180 top
T5  1200980090**TRANS SMD NPN BC847B SOT-23  [SOT23-BEC]  118.89,32.91 90 top
T6  1200980090**TRANS SMD NPN BC847B SOT-23  [SOT23-BEC]  38.25,40.02 90 top
T7  1200980090**TRANS SMD NPN BC847B SOT-23  [SOT23-BEC]  84.63,14.46 270 top
T9  1200980090**TRANS SMD NPN BC847B SOT-23  [SOT23-BEC]  87.23,15.82 180 top
T10  1049-1012**MMBTA56 PNP 80V 500mA 330mW hfe(min):100 SOT23  [SOT23-BEC]  91.96,12.13 0 top
TRF1  0319-7458**SMPS TRAFO 90W E36/18/11 2*60uH (Insulation Improved 0319-7451) DBC2  [DEIF_TRF]  82.77,74.53 270 top
TVS1  1119-3061**5V 130W TVS Diode SOD-323  [SOD323]  57.92,15.01 270 top
U1  1039-2220**STM32F072C8T6 64K Flash USB, CAN  [STM32F072CXXX_LQFP48]  50.76,30.6 0 top
U2  1039-2392**LMR16006XDDCR 0.6A, 0.7MHz Step-Down Converter in a TSOT-6L, Input 4V to 60V  [AOZ1282CI-1]  46.8,41.9 0 top
U$1  [SERI_NO_ETIKET_ALANI]  82.66,73.95 180 bottom
U$2  [EN-KO_AMLEMI]  50.36,67.67 0 top
U$3  [EN-KO_AMLEMI]  39.33,59.08 0 bottom
U$4  [ROHS]  37.78,105.11 0 bottom
U$5  [FT-ICT]  66,73.88 0 bottom
VR1  0169-2013**Varistor 20mm 300V  [S20K40]  12.23,19.31 270 top
X1  0289-1472**WR-TBL Series 3134 - 3 kutup 7.62 mm Close Hor. PCB Header (Wurth 691 313 410 003)  [GMSTBA3]  23.4,0.91 0 top
X1-K  0289-1473**WR-TBL Series 3524 - 3 kutup 7.62 mm Hor. w. Hook on Wire Side (Wurth 691 352 410 003)  [SOKET]  -5.84,108.2 0 top  (outside the outline)
X2  0309-1064**USB Type-B Mini Connector Horizantal  [USB_B(YATIK)]  55,5 90 top
X3  0289-1470**WR-TBL Series 313 - 4 kutup 5.08 mm Close Hor. PCB Header (Wurth 691 313 510 004)  [MSTBA4]  99.83,0.91 0 top
X3-K  0289-1471**WR-TBL Series 352 - 4 kutup 5.08 mm Hor. with Hook on Wire Side (wurth 691 352 510 004)  [SOKET]  -5.84,107.46 0 top  (outside the outline)
X4  0289-1474**WR-TBL Series 313 - 3 kutup 5.08 mm Close Hor. PCB Header (Wurth 691 313 510 003)  [MSTBA3]  74.87,0.91 0 top
X4-K  0289-1475**WR-TBL Series 352 - 3 kutup 5.08 mm Hor. with Hook on Wire Side (wurth 691 352 510 003)  [SOKET]  -5.86,106.63 0 top  (outside the outline)
Y1  1149-0013**Crystal 16MHz ±10ppm 10pF 120 Ohms 4-SMD, No Lead 2.00mm x 1.60mm  [NX2016SA-32M]  50.9,22.7 270 top
Z1  1129-1195**ZENER SOT23 18V 400mW %5 BZX84C18V  [SOT23]  35.75,68.7 90 top
Z3  1129-1146**ZENER SOT23 2V7 300mW BZX84C2V7  [SOT23]  37.9,48.6 0 top
Z4  1129-1162**ZENER SOT23 3V9 300mW BZX84C3V9  [SOT23]  74.5,16.64 270 top
Z5  1129-1151**ZENER SOT23 12V 225mW BZX84C12  [SOT23]  40.73,51.04 90 top
Z6  1129-1146**ZENER SOT23 2V7 300mW BZX84C2V7  [SOT23]  38.6,43.24 90 top
Z7  1129-1151**ZENER SOT23 12V 225mW BZX84C12  [SOT23]  83.55,21.17 180 top
Z8  1129-1140**ZENER SOT23 5V1 0.4W BZX84C5V1  [SOT23]  90.41,15.82 180 top

## Tracks (layer width: path | path; a pad name or v marks a point on that pad's centre or on a via)
13.8V+  (via drill 0.35)
  Top 0.254: 37.91,54.69 37.41,54.19 37.41,52.8 R127.2 | C85.1
  Top 0.305: 110.51,2.81 110.83,2.81 111.92,3.9 R50.1 | 110.51,2.81 110.11,2.81 | 110.11,2.81 109.81,2.81 | 109.81,2.81 89.15,2.81 | R117.1 87.97,3.99 89.15,2.81 | 110.51,2.81 111.7,4 111.7,4.4 | 110.11,2.81 111.7,4.4 | 111.7,4.4 111.7,4.6 | 109.81,2.81 111.95,4.95 C72.2 | 89.15,2.81 88.88,2.81 | 87.71,3.98 88.88,2.81 | 88.88,2.81 88.61,2.81 | 88.61,2.81 87.63,3.79 | 88.61,2.81 88.3,2.81 | 88.3,2.81 87.42,3.69 | 88.3,2.81 87.99,2.81 | 87.16,3.64 87.99,2.81 | 87.99,2.81 87.66,2.81 | 86.79,3.68 87.66,2.81 | 87.66,2.81 87.31,2.81 | 87.31,2.81 86.49,3.63 | 87.31,2.81 87.12,2.81 | 87.12,2.81 86.06,3.87 | 87.12,2.81 86.7,2.81 | 85.52,3.99 86.7,2.81 | 86.7,2.81 86.35,2.81 | 86.35,2.81 85.17,3.99 | 86.35,2.81 86.07,2.81 | 84.89,3.99 86.07,2.81 | 86.07,2.81 85.76,2.81 | 85.76,2.81 84.58,3.99 | 85.76,2.81 85.59,2.81 | 85.59,2.81 84.41,3.99 | 85.59,2.81 85.45,2.81 84.3,3.96 | 37.91,54.99 OC2.1 | 38.83,52.67 v39.2,52.3 | 38.83,52.67 38.99,52.23 v39.2,52.3 | 38.83,52.67 39.28,52.51 v39.2,52.3
  Top 0.406: 61.49,50.39 61.89,50.8 61.98,50.8 62.68,50.1 | 61.49,50.39 61.11,50.02 61.08,50.02 | 61.08,50.02 60.98,50.02 | C72.2 R50.1 | 61.08,49.2 61.08,50.02 | 61.49,49.9 61.49,50.39 | 55.43,56.55 55.45,56.53 C88.P$1 | 37.91,55.7 OC2.1 | v80.77,21.3 80.77,20.77 | R110.2 80.77,20.77 | R127.2 37.51,52.9 38.6,52.9 38.83,52.67 | 80.77,20.77 80.94,21.24 v80.77,21.3 | 80.77,20.77 80.61,21.24 v80.77,21.3
  Top 0.508: D7.A 61.89,49.52 | 82.31,55.92 82.04,55.92 | 79.81,57.33 79.08,56.59 79.08,56.3 79.54,55.84 | 79.81,57.33 TRF1.43 | 79.97,57.17 79.81,57.33 | TRF1.22 80.31,56.76 80.75,56.32 80.87,56.32 | 84.12,56.63 83.64,56.15 83.32,56.15 | 84.12,56.63 84.94,57.45 | 84.94,57.45 TRF1.44 85.82,57.24 85.82,56.65 | 82.35,56.15 82.74,56.15 | 82.74,56.15 82.81,56.15 | 82.81,56.15 83.32,56.15 | 83.27,56.63 84.12,56.63 | 83.07,55.85 83.61,55.85 | 83.61,55.85 84.18,55.85 84.61,56.28 | 84.61,56.28 84.94,56.6 84.94,57.45 | 83.94,56.28 84.61,56.28 | 84.91,56.79 TRF1.21 85.28,56.69 | 82.44,56.44 80.22,56.54 82.44,56.44 | 77.94,43.35 78.17,43.13 v78.17,42.88 | 77.94,43.35 77.86,43.44 | 77.86,43.44 77.35,43.95 C37.1 | R117.1 85.52,3.99 85.17,3.99 84.89,3.99 84.58,3.99 84.41,3.99 83.92,4.48 83.92,6.82 | 83.92,6.82 83.92,6.93 | 83.92,6.93 v83.92,7.46 | 82.81,56.15 83.48,55.97 | 83.48,55.97 84.96,55.59 82.81,56.15 | 82.81,56.15 83.11,56.44 | 83.11,56.44 84.41,57.69 82.81,56.15 | 77.86,43.44 78.05,42.84 | 77.86,43.44 78.27,42.96 | 83.92,6.82 84.04,7.44 | 84.04,7.44 | v83.92,7.46 84.04,7.44 | 83.92,6.82 83.9,6.94 | 83.8,7.44 | v83.92,7.46 83.8,7.44 | 82.74,56.15 82.44,56.44 | 82.44,56.44 81.14,57.69 | 82.74,56.15 80.59,55.59 | 82.07,55.97 81.47,58.12 82.07,55.97 | 82.44,56.44 81.37,58.39 | 82.07,55.97 79.93,56.59 | 83.32,56.15 85.5,56.56 | 83.32,56.15 84.11,58.23 | 83.61,55.85 85.7,56.62 | 83.61,55.85 84.05,58.03 | 83.48,55.97 85.62,56.59 | 83.48,55.97 84.07,58.12 | 83.11,56.44 85.33,56.54 | 83.11,56.44 84.18,58.39 | 77.94,43.35 | 77.9,43.33 78.26,42.97 | v78.17,42.88 78.26,42.97 | 77.94,43.35 78.05,42.85 | v78.17,42.88 78.05,42.85 | 77.94,43.35 78.27,42.96 | 78.27,42.96 | v78.17,42.88 78.27,42.96
  Top 0.508: 77.94,43.35 78.05,42.85 | v78.17,42.88 78.05,42.85 | 77.94,43.35 78.27,42.96 | v78.17,42.88 78.27,42.96 | 77.9,43.33 78.05,42.84 | v78.17,42.88 78.05,42.84 | 77.9,43.33 78.26,42.97 | v78.17,42.88 78.26,42.97 | v78.17,42.88 78.05,42.85 77.94,43.35 78.27,42.96 | v78.17,42.88 78.27,42.96 | 83.92,6.93 84.04,7.43 | v83.92,7.46 84.04,7.43 | 83.92,6.93 83.8,7.43 | v83.92,7.46 83.8,7.43 | 83.92,6.93 84.04,7.43 | 83.92,6.93 83.8,7.43 | 83.92,6.93 84.04,7.43 | v83.92,7.46 84.04,7.43 | 83.92,6.93 83.8,7.43 | v83.92,7.46 83.8,7.43 | 84.04,7.44 83.94,6.94 83.8,7.42 v83.92,7.46 | v83.92,7.46 84.04,7.44 | 83.9,6.94 84.04,7.42 v83.92,7.46 | 83.9,6.94 83.8,7.44 | v83.92,7.46 83.8,7.44
  Top 0.61: R78.2 78.09,40.03 v78.1,40.04 | OC2.1 37.91,54.69 | D7.A 61.89,50.8 61.89,52.68 62.54,53.33 76.81,53.33 | 76.81,53.33 78.47,54.99 | 78.47,54.99 | 78.47,54.99 79.04,55.55 | 79.04,55.55 TRF1.22 | 76.81,53.33 77.51,53.33 | 80.14,55.96 79.53,55.35 | 79.53,55.35 78.85,54.67 | 78.85,54.67 77.51,53.33 | 77.51,53.33 78.28,53.33 | 78.28,53.33 79.36,54.41 | 79.36,54.41 80.19,55.24 | 80.19,55.24 80.7,55.75 | 78.28,53.33 78.6,53.33 | 78.6,53.33 79.6,54.33 | 79.6,54.33 80.52,55.25 | 80.52,55.25 81.76,56.49 81.49,56.76 80.31,56.76 | 78.6,53.33 79.45,53.33 | 82.04,55.92 80.36,54.24 | 80.36,54.24 79.45,53.33 | 79.45,53.33 79.72,53.33 | 79.72,53.33 80.66,54.27 | 80.66,54.27 82.31,55.92 | 79.72,53.33 80.55,53.33 82.95,55.73 | 82.95,55.73 83.07,55.85 | 78.47,54.99 | 79.59,55.33 80.62,55.65 79.59,55.33 | 78.47,54.99 78.71,55.77 | 78.71,55.77 79.13,57.14 78.71,55.77 | 79.36,54.41 80.31,55.23 | 79.11,57.53 | 80.31,55.23 | 80.31,55.23 | 80.31,55.23 79.23,57.21 | 79.15,57.37 | 79.36,54.41 80.31,55.23 | 80.31,55.23 81.06,55.89 80.31,55.23 | 79.94,55.26 81.25,57.09 | 80.31,55.23 | 80.46,55.24 81.37,57.3 | 79.23,57.21 | 78.85,54.67 79.94,55.26 | 79.94,55.26 | 79.94,55.26 | 79.94,55.26 | 79.94,55.26 80.84,55.74 | 79.6,54.33 80.46,55.24 | 80.46,55.24 81.15,55.97 | 79.94,55.26 | 79.94,55.26 81.25,57.09 | 79.94,55.26 | 78.47,54.99 | 78.85,54.67 79.94,55.26 | 79.94,55.26 | 79.94,55.26 80.84,55.74 | 79.94,55.26 | 79.94,55.26 81.25,57.09 | 79.94,55.26 79.16,57.37 | 83.84,55.68 84.09,57.92 | 84.09,57.92 | 83.84,55.68 84.09,57.92 | 83.84,55.68 | 83.84,55.68 84.09,57.92 | 82.95,55.73 83.84,55.68 | 83.84,55.68 | 83.84,55.68 85.2,55.6 | 82.95,55.73 83.3,56.18 | 83.3,56.18 84.33,57.52 | 82.95,55.73 83.84,55.68 | 83.84,55.68 85.2,55.6
  Top 0.61: 82.95,55.73 83.3,56.18 | 83.3,56.18 84.33,57.52 | 81.25,57.09 | 79.94,55.26 79.16,57.37 | 78.47,54.99 79.59,55.33 | 78.47,54.99 78.71,55.77 | 78.47,54.99 79.59,55.33 | 78.47,54.99 78.71,55.77 | 78.85,54.67 80.84,55.74 | 78.85,54.67 78.95,55.61 | 78.95,55.61 79.09,56.91 | 79.36,54.41 80.31,55.23 | 79.36,54.41 79.23,55.46 | 79.23,55.46 79.09,56.65 | 79.6,54.33 80.46,55.24 | 80.46,55.24 81.15,55.97 | 79.6,54.33 | 79.36,55.41 79.11,56.53 79.36,55.41 | 79.6,54.33 80.46,55.24 | 80.46,55.24 81.15,55.97 | 79.6,54.33 79.36,55.41 | 80.36,54.24 81.35,56.27 | 80.36,54.24 79.76,55.29 | 79.76,55.29 79.24,56.19 | 80.66,54.27 81.04,55.35 | 81.04,55.35 81.4,56.4 | 80.66,54.27 79.93,55.26 | 79.93,55.26 79.32,56.08 | 79.94,55.26 79.16,57.37 | 79.94,55.26 81.25,57.09 | 81.25,57.09 | 79.94,55.26 79.16,57.37 | 79.16,57.37 | 80.88,55.31 79.38,56.99 | 79.94,55.26 81.25,57.09 | 81.25,57.09 | 79.94,55.26 79.16,57.37 | 80.31,55.23 79.23,57.21 | 79.23,57.21 | 79.94,55.26 81.25,57.09 | 79.94,55.26 79.16,57.37 | 79.16,57.37 | 80.46,55.24 81.37,57.3 | 80.46,55.24 79.26,57.15 80.46,55.24 | 79.59,55.33 81.14,56.96 | 79.59,55.33 79.11,57.53 | 78.71,55.77 80.77,56.7 | 78.71,55.77 79.1,57.99 | 79.94,55.26 81.25,57.09 | 79.94,55.26 79.16,57.37 | 78.95,55.61 80.89,56.76 | 78.95,55.61 79.08,57.85 | 80.31,55.23 81.34,57.24 | 81.34,57.24 | 80.31,55.23 79.23,57.21 | 80.31,55.23 81.34,57.24 | 80.31,55.23 79.23,57.21 | 79.23,55.46 81.01,56.84 | 79.23,55.46 79.08,57.7 | 80.46,55.24 81.37,57.3 | 79.36,55.41 81.06,56.88 | 79.36,55.41 79.09,57.64 | 80.88,55.31 81.43,57.49 | 80.88,55.31 79.38,56.99 | 79.76,55.29 81.2,57.02 | 79.76,55.29 79.13,57.45 | 81.04,55.35 81.45,57.57 | 81.04,55.35 79.44,56.93 | 79.93,55.26 81.24,57.09
  Top 0.61: 79.93,55.26 79.15,57.37 | 79.04,55.55 80.93,56.78 | 79.04,55.55 79.08,57.81 | 79.53,55.35 81.12,56.94 | 79.53,55.35 79.1,57.56 | 80.19,55.24 81.31,57.19 | 80.19,55.24 79.2,57.26 | 80.52,55.25 81.38,57.33 | 80.52,55.25 79.28,57.13 | 83.3,56.18 | 83.84,55.68 85.83,56.73 | 85.83,56.73 | 83.84,55.68 84.09,57.92 | 83.3,56.18 84.17,58.25 | 83.84,55.68 84.09,57.92 | 83.3,56.18 85.5,56.61 | 83.3,56.18 84.17,58.25 | 83.84,55.68 84.09,57.92 | 84.09,57.92 83.84,55.68 | 83.3,56.18 84.17,58.25 | 83.84,55.68 85.83,56.73 | 83.84,55.68 84.09,57.92 | 83.3,56.18 85.5,56.61 | 85.5,56.61 | 83.3,56.18 | 83.84,55.68 85.83,56.73 | 83.3,56.18 85.5,56.61 | 83.3,56.18 84.17,58.25 | 82.95,55.73 85.2,55.6 | 85.2,55.6 | 82.95,55.73 84.33,57.52 | 82.95,55.73 85.2,55.6 | 82.95,55.73 84.33,57.52
  Top 0.813: C36.1 77.31,44.15 C37.1 | C72.2 111.95,3.93 111.92,3.9 | v103.75,14.18 103.4,14.53 102.23,14.53 C85.1 | 55.45,56.53 55.51,55.83 C88.P$1 56.15,56.47 55.45,56.53
  Top 1.016: C86.1 98.14,23.17
  Bottom 0.406: 81.27,21.46 80.94,21.46 v80.77,21.3 | 81.27,21.46 84.3,21.46 | v39.2,52.3 39.57,52.67 | 39.57,52.67 41.8,54.9 54.55,54.9 | 81.27,21.46 80.78,21.48 v80.77,21.3 | 81.27,21.46 80.88,21.16 v80.77,21.3 | 39.57,52.67 39.12,52.46 v39.2,52.3 | 39.57,52.67 39.36,52.23 v39.2,52.3 | 54.55,54.9 55.25,54.9 C88.P$1 | C88.P$1 55.85,56.03 55,55.05 54.55,54.9 | 54.65,54.95 55.5,55.93 C88.P$1
  Bottom 0.508: v83.92,7.46 84.24,7.78 84.24,7.88 | 84.24,7.88 84.24,8.02 | 84.24,8.02 84.24,19.75 | 84.24,19.75 84.24,20.2 | 84.24,20.2 84.24,20.75 | 84.24,20.75 84.24,21.4 | 98.22,23.16 97.5,22.44 90.02,22.44 88.78,21.2 86.4,21.2 | 98.22,23.16 99.28,24.22 | 98.22,23.16 99.71,24 | 84.24,8.02 83.83,7.54 | v83.92,7.46 83.83,7.54 | 84.24,8.02 84.2,7.9 | 84.24,21.4 84.22,21.39 81.29,21.39 | v80.77,21.3 81.03,21.3 81.12,21.39 81.29,21.39 | 84.16,7.93 83.83,7.54 | 84.16,7.93 | 84.16,7.93 84.04,7.43 | v83.92,7.46 84.04,7.43 | 84.24,7.88 83.84,7.56 v83.92,7.46 | 84.24,7.88 84.03,7.41 v83.92,7.46 | 84.16,7.93 83.83,7.54 | v83.92,7.46 83.83,7.54 | 84.16,7.93 84.04,7.43 | v83.92,7.46 84.04,7.43 | 84.2,7.9 83.83,7.55 v83.92,7.46 | 84.2,7.9 84.04,7.42 v83.92,7.46 | 81.29,21.39 80.78,21.42 v80.77,21.3 | 81.29,21.39 80.82,21.19 v80.77,21.3 | 84.24,21.4 85.89,21.4 | 86.4,21.2 86.2,21.4 85.89,21.4 | 84.24,19.75 85.55,21.05 | 85.55,21.05 85.89,21.4 | 84.24,20.2 84.94,20.91 | 84.94,20.91 85.09,21.05 85.55,21.05 | 84.24,20.75 84.4,20.91 84.94,20.91 | 84.94,20.91 86.1,20.91 86.4,21.2
  Bottom 1.27: X3.1 92.2,11.47 95.03,14.3
  Bottom 1.5: 112.53,68.39 C73.1 115.79,69.36 C18.P$1 116.84,69.27 115.96,68.39 112.53,68.39 | 112.53,68.39 106.48,68.39 105.22,69.65 C24.P$1
  other vias: 95.73,25.37 96.73,25.37 97.83,25.37 98.83,25.37 95.7,27.38 96.7,27.38 97.8,27.38 98.8,27.38 102.99,28.47 101.99,28.47 100.89,28.47 99.89,28.47 95.73,28.49 96.73,28.49 97.83,28.49 98.83,28.49 103.02,29.58 102.02,29.58 100.92,29.58 99.92,29.58 95.77,29.54 96.77,29.54 97.87,29.54 98.87,29.54 102.06,30.63 100.96,30.63 99.96,30.63 95.72,26.35 96.72,26.35 97.82,26.35 98.82,26.35 95.76,30.63 96.76,30.63 97.86,30.63 98.86,30.63 95.79,31.74 96.79,31.74 97.89,31.74 98.89,31.74 95.83,32.79 96.83,32.79 97.93,32.79 98.93,32.79 100,31.75 100,32.79 101.05,31.76 101.11,32.76 99.88,27.37 114.4,20.6 114.4,19.6 114.4,18.5 114.4,17.5 115.9,20.6 115.9,19.6 115.9,18.5 115.9,17.5 117.2,17.5 117.2,18.5 117.2,19.6 117.2,20.6 101.56,26.53 102.56,26.53 103.66,26.53 104.66,26.53 101.56,25.48 102.56,25.48 103.66,25.48 104.66,25.48 109.03,26.53 108.03,26.53 106.93,26.53 105.93,26.53 109.05,25.46 108.05,25.46 106.95,25.46 105.95,25.46 105.93,24.31 106.93,24.31 108.03,24.31 105.93,23.22 106.93,23.22 108.03,23.22 105.92,22.06 106.92,22.06 108.02,22.06 106.99,17.83 106.99,18.83 106.99,19.93 106.99,20.93 105.92,20.94 105.92,19.94 105.92,18.84 105.92,17.84 108.11,17.84 108.11,18.84 108.11,19.94 108.11,20.94 110.08,26.56 111.08,26.56 112.18,26.56 110.08,25.51 111.08,25.51 112.18,25.51
  pour Top (isolate 0.305, no thermals): 60.43,54.52 62.95,57.04 62.95,59.44 63.36,59.85 78.57,59.85 78.9,59.52 78.9,55.84 79.34,55.4 86.29,55.4 86.66,55.77 86.66,60.32 87.82,61.48 99.91,61.48 106.1,67.67 106.1,71.17 105.58,71.69 104.85,71.69 104.36,71.2 104.36,69.82 98.24,63.7 63.94,63.7 57.88,57.64 57.88,57.7 56.27,57.7 55.61,57.04 55.61,55.18 56.27,54.52
  pour Bottom (isolate 0.305, no thermals): 79.04,55.28 77.64,53.88 77.64,51.67 76.96,50.99 76.96,39.99 77.56,39.39 79.82,39.39 94.8,24.46 94.89,24.37 94.89,23.04 94.31,22.46 94.46,22.31 96.77,22.3 96.85,22.38 99.07,22.38 100.26,23.57 100.26,26.96 100.84,27.54 106.47,27.54 106.93,28 106.93,32.47 99.11,40.29 96.39,40.29 95.27,41.41 95.27,46.28 88.12,53.43 88.12,58.67 87.71,59.08 79.26,59.08 79.04,58.86
  pour Top (isolate 0.305, no thermals): 94.86,28.73 92.36,31.23 92.36,33.21 92.74,33.59 105.64,33.59 106.75,32.48 106.75,28.43 105.59,27.27 101.1,27.27 101.1,22.41 95.66,22.41 94.86,23.21
  pour Bottom (isolate 0.305, no thermals): 95.06,2.71 94.56,2.21 83.92,2.21 82.98,3.15 82.98,5.4 84.93,7.35 84.93,17.27 89.4,21.74 99.24,21.74 100.83,23.33 100.83,26.54 101.22,26.93 112.33,26.93 112.77,26.49 112.77,23.16 114.21,21.72 119.59,21.72 120.47,20.84 120.47,12.66 119.04,11.23 109.57,11.23 108.89,11.91 108.89,12.95 107.9,13.94 96.99,13.95 95.06,12.02
  pour Top (isolate 0.305, no thermals): 93.29,7.92 93.77,7.44 94.13,7.08 94.13,4.95 94.13,4.09 93.66,3.62 89.4,3.62 88.94,4.08 88.82,4.2 88.82,7.3 89.44,7.92
  pour Top (isolate 0.305, no thermals): 100.61,26.96 100.94,27.29 112.27,27.29 113.58,25.98 113.58,24.16 114.59,23.15 119.67,23.15 120.4,22.42 120.4,16.94 119.4,15.94 114.31,15.94 113.13,14.76 113.13,11.77 112.37,11.01 109.72,11.01 108.83,11.9 108.83,13.69 111.26,16.12 111.26,21.79 110.73,22.32 109.51,22.34 108.77,21.6 108.77,18.13 108.14,17.5 105.92,17.5 105.5,17.92 105.5,21.8 104.89,22.41 101.1,22.41 100.61,22.9
+3V3  (via drill 0.35)
  Top 0.254: 46.34,12.26 R100.2 | 69.77,20.63 69.6,21.18 | C45.1 81.8,30.79 81.8,29.18 | 69.69,20.89 69.85,20.46 v70.09,20.54 70.14,20.79 69.69,20.89
  Top 0.305: v70.09,20.54 69.86,20.54 69.77,20.63 69.62,20.78 | 69.62,20.78 69.53,20.87 | 69.53,20.87 69.5,20.9 69.5,20.91 69.5,23.93 69.06,24.37 65.75,24.37 | C39.1 44.09,26.51 45.65,26.51 | C55.1 48.01,35.88 U1.36 | U1.24 57.38,33.35 C48.1 56.35,33.44 56.03,33.76 | IC4.3 65.4,24.02 65.75,24.37 | C54.1 58.14,23.64 | 47.24,38.02 47.35,38.13 C57.1 47.61,37.87 47.61,36.88 | v55.57,34.22 55.94,33.84 | 55.94,33.84 56.03,33.76 | 59.38,34.25 59.38,35.63 58.32,36.69 | 59.38,34.25 59.38,33.79 | v40.53,36.68 41.06,36.68 | 41.06,36.68 41.14,36.68 41.16,36.7 41.17,36.7 | 41.17,36.7 43.02,36.7 43.03,36.69 44.54,36.69 | 45.41,36.56 45.28,36.69 44.54,36.69 | 65.75,24.37 64.76,24.37 64.64,24.25 | 45.39,25.74 45.39,26.24 45.47,26.33 | 46.32,27.17 46.51,27.37 U1.48 | 46.32,27.17 45.69,26.54 | 45.65,26.51 45.47,26.33 | 45.47,26.33 44.36,26.33 | 45.69,26.54 45.69,25.42 45.47,25.2 | 45.69,26.54 45.65,26.51 | D13.2 58.05,36.97 58.32,36.69 | 58.32,36.69 57.37,36.69 | v55.57,34.22 55.94,33.85 55.94,33.84 | 55.94,33.84 55.94,33.69 | 55.94,33.69 55.94,33.41 | 44.54,36.69 45.08,36.16 45.22,36.16 | 47.35,37.1 47.23,37.1 46.56,36.42 46.56,36.7 47.35,37.49 47.16,37.49 46.09,36.42 | 59.38,34.25 58.57,33.44 58.49,33.44 | 46.32,27.17 46.32,27.72 46.3,27.75 | 69.53,20.87 69.61,20.77 | 69.53,20.87 70.13,20.77 | 41.17,36.7 40.6,36.89 | 41.17,36.7 41.05,36.65 | 56.03,33.76 55.97,33.88 | 56.03,33.76 55.91,33.81 | 55.94,33.69 55.91,33.81 | 55.94,33.69 55.83,33.76 | 69.62,20.78 69.91,20.41 | v70.09,20.54 69.91,20.41 | 69.62,20.78 70.09,20.77 | v70.09,20.54 70.09,20.77 | 69.61,20.77 69.91,20.4 | v70.09,20.54 69.91,20.4 | 69.66,20.85 | 69.66,20.85 69.89,20.43 | 69.89,20.43 | 69.66,20.85
  Top 0.305: 69.66,20.85 70.13,20.77 | v70.09,20.54 70.13,20.77 | 40.64,36.88 | v40.53,36.68 40.64,36.88 | 41.05,36.65 40.62,36.47 | v40.53,36.68 40.62,36.47 | 55.97,33.88 55.52,34 | v55.57,34.22 55.52,34 | 55.91,33.81 55.79,34.27 | v55.57,34.22 55.79,34.27 | 55.48,34.01 | v55.57,34.22 55.48,34.01 | 55.83,33.76 | 55.83,33.76 55.8,34.23 | 69.66,20.85 69.89,20.43 | v70.09,20.54 69.89,20.43 | 69.66,20.85 70.13,20.77 | v70.09,20.54 70.13,20.77 | 69.62,20.78 69.91,20.41 | v70.09,20.54 69.91,20.41 | 69.62,20.78 70.09,20.77 | v70.09,20.54 70.09,20.77 | 69.61,20.77 69.91,20.4 | v70.09,20.54 69.91,20.4 | 69.61,20.77 70.09,20.77 v70.09,20.54 | 69.66,20.85 70.13,20.77 | v70.09,20.54 70.13,20.77 | 69.66,20.85 69.89,20.43 | v70.09,20.54 69.89,20.43 | 69.66,20.85 70.13,20.77 | v70.09,20.54 70.13,20.77 | 41.05,36.74 40.65,36.49 | v40.53,36.68 40.65,36.49 | 41.06,36.68 40.63,36.88 | 40.63,36.88 | v40.53,36.68 40.63,36.88 | 41.06,36.68 40.63,36.48 | v40.53,36.68 40.63,36.48 | 41.06,36.68 40.63,36.88 | v40.53,36.68 40.63,36.88 | 41.06,36.68 40.63,36.48 | v40.53,36.68 40.63,36.48 | 41.05,36.74 40.6,36.89 | v40.53,36.68 40.6,36.89 | 41.05,36.74 40.65,36.49 | v40.53,36.68 40.65,36.49 | 41.05,36.65 40.64,36.88 | v40.53,36.68 40.64,36.88 | 41.05,36.65 40.62,36.47 | v40.53,36.68 40.62,36.47 | 55.94,33.84 55.79,34.29 v55.57,34.22 | 55.94,33.84 55.5,34 v55.57,34.22 | 55.94,33.84 55.79,34.29 v55.57,34.22 | 55.94,33.84 55.5,34.01 v55.57,34.22 | 55.97,33.88 55.78,34.31 v55.57,34.22 | 55.97,33.88 55.52,34 | v55.57,34.22 55.52,34 | 55.91,33.81 55.79,34.27 | v55.57,34.22 55.79,34.27 | 55.91,33.81 55.48,34.01 v55.57,34.22 | 55.91,33.81 55.79,34.27 v55.57,34.22 | 55.91,33.81 55.48,34.01 | v55.57,34.22 55.48,34.01
  Top 0.305: 55.83,33.76 55.8,34.23 | v55.57,34.22 55.8,34.23 | 55.83,33.76 55.44,34.03 | 55.44,34.03 | v55.57,34.22 55.44,34.03 | 55.83,33.76 55.8,34.23 | v55.57,34.22 55.8,34.23 | 55.83,33.76 55.44,34.03 | v55.57,34.22 55.44,34.03
  Top 0.406: 59.38,33.79 C49.1 | 47.23,36.42 C55.1 | v80.12,27.68 80.43,27.68 80.61,27.86 | 80.7,27.95 80.98,28.22 80.98,28.65 | 80.7,27.95 80.61,27.86 | 80.98,28.95 81.11,29.09 | 80.99,29.21 81.11,29.09 | 81.11,29.09 81.2,29.18 | 81.5,29.18 81.8,29.18 83.99,29.18 IC5.8 | 81.5,29.18 81.2,29.18 | 81.2,29.18 81.07,29.18 80.98,29.27 80.98,28.95 | 80.98,28.95 80.98,28.65 | 80.98,28.65 81.5,29.18 | 80.7,27.95 80.58,27.93 | 80.7,27.95 80.61,27.87 | 80.61,27.87 80.23,27.54 | v80.12,27.68 80.23,27.54 | 80.61,27.86 80.12,27.85 v80.12,27.68 | 80.61,27.86 80.23,27.54 v80.12,27.68 | 80.58,27.93 80.09,27.85 v80.12,27.68 | 80.58,27.93 80.25,27.56 v80.12,27.68 | 80.61,27.87 80.11,27.85 v80.12,27.68 | 80.61,27.87 80.23,27.54 | v80.12,27.68 80.23,27.54